# Altium schematic sheet adda副2.SchDoc
size A3
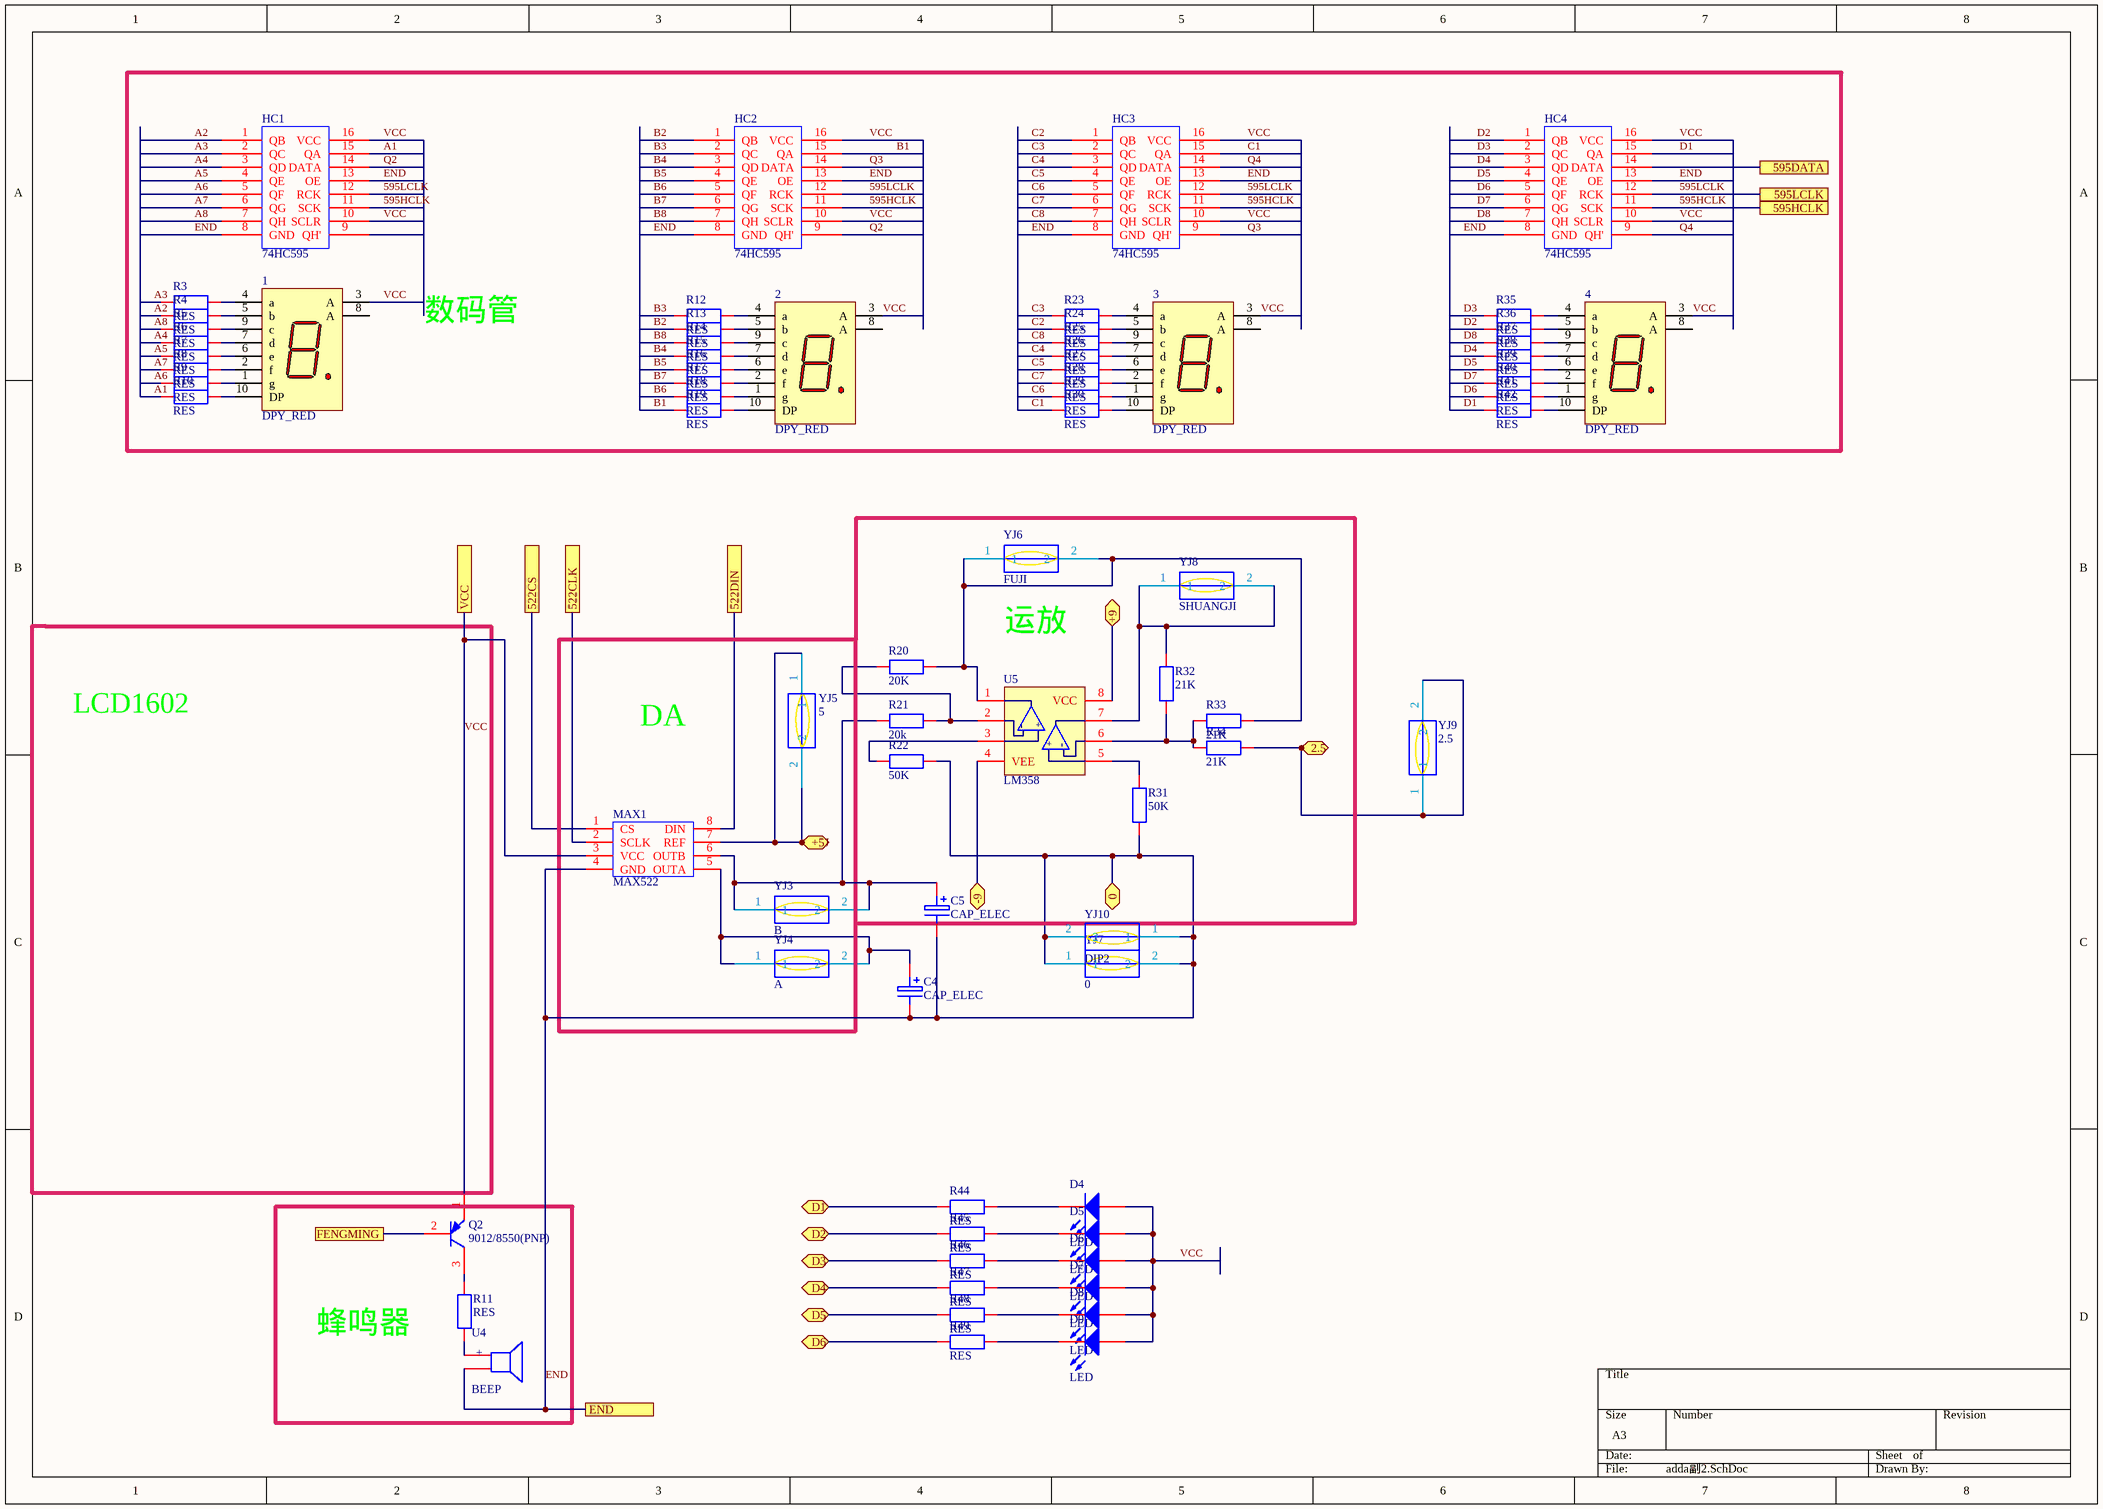
[diagram p0: adda副2.SchDoc]

## Parts
1  DPY_RED  [7SEG_8]
2  DPY_RED  [7SEG_8]
3  DPY_RED  [7SEG_8]
4  DPY_RED  [7SEG_8]
C4  CAP_ELEC  [CAP[16V]]
C5  CAP_ELEC  [CAP[16V]]
D4  LED  [LED]
D5  LED  [LED]
D6  LED  [LED]
D7  LED  [LED]
D8  LED  [LED]
D9  LED  [LED]
HC1  74HC595  [DIP_16]
HC2  74HC595  [DIP_16]
HC3  74HC595  [DIP_16]
HC4  74HC595  [DIP_16]
MAX1  MAX522  [DIP_8]
Q2  9012/8550(PNP)  [TO_92]
R3  RES  [RES_DIP]
R4  RES  [RES_DIP]
R5  RES  [RES_DIP]
R6  RES  [RES_DIP]
R7  RES  [RES_DIP]
R8  RES  [RES_DIP]
R9  RES  [RES_DIP]
R10  RES  [RES_DIP]
R11  RES  [RES_DIP]
R12  RES  [RES_DIP]
R13  RES  [RES_DIP]
R14  RES  [RES_DIP]
R15  RES  [RES_DIP]
R16  RES  [RES_DIP]
R17  RES  [RES_DIP]
R18  RES  [RES_DIP]
R19  RES  [RES_DIP]
R20  20K  [RES_DIP]
R21  20k  [RES_DIP]
R22  50K  [RES_DIP]
R23  RES  [RES_DIP]
R24  RES  [RES_DIP]
R25  RES  [RES_DIP]
R26  RES  [RES_DIP]
R27  RES  [RES_DIP]
R28  RES  [RES_DIP]
R29  RES  [RES_DIP]
R30  RES  [RES_DIP]
R31  50K  [RES_DIP]
R32  21K  [RES_DIP]
R33  21K  [RES_DIP]
R34  21K  [RES_DIP]
R35  RES  [RES_DIP]
R36  RES  [RES_DIP]
R37  RES  [RES_DIP]
R38  RES  [RES_DIP]
R39  RES  [RES_DIP]
R40  RES  [RES_DIP]
R41  RES  [RES_DIP]
R42  RES  [RES_DIP]
R44  RES  [RES_DIP]
R45  RES  [RES_DIP]
R46  RES  [RES_DIP]
R47  RES  [RES_DIP]
R48  RES  [RES_DIP]
R49  RES  [RES_DIP]
U4  BEEP  [BEEP]
U5  LM358  [DIP_8]
YJ3  B  [DIP2]
YJ4  A  [DIP2]
YJ5  5  [DIP2]
YJ6  FUJI  [DIP2]
YJ7  0  [DIP2]
YJ8  SHUANGJI  [DIP2]
YJ9  2.5  [DIP2]
YJ10  DIP2  [DIP2]

## Blocks framed on the sheet
数码管: 1-4 HC1-HC4 R3-R10 R12-R19 R23-R30 R35-R42
DA: MAX1 YJ3-YJ5
蜂鸣器: Q2 R11 U4

## Ports
0, 2.5, 522CLK, 522CS, 522DIN, 595DATA, 595HCLK, 595LCLK, +5J, +9, -9, D1, D2, D3, D4, D5, D6, END, FENGMING, VCC

## Nets
2.5: R34.1 YJ9.1 YJ9.2 ; port 2.5
522CLK: MAX1.2(SCLK) ; port 522CLK
522CS: MAX1.1(CS) ; port 522CS
522DIN: MAX1.8(DIN) ; port 522DIN
595DATA: HC4.14(DATA) ; port 595DATA
595HCLK: HC1.11(SCK) HC2.11(SCK) HC3.11(SCK) HC4.11(SCK) ; port 595HCLK
595LCLK: HC1.12(RCK) HC2.12(RCK) HC3.12(RCK) HC4.12(RCK) ; port 595LCLK
+5J: MAX1.7(REF) YJ5.1 YJ5.2 ; port +5J
+9: U5.8(VCC) ; port +9
-9: U5.4(VEE) ; port -9
A1: HC1.15(QA) R10.1
A2: HC1.1(QB) R4.1
A3: HC1.2(QC) R3.1
A4: HC1.3(QD) R6.1
A5: HC1.4(QE) R7.1
A6: HC1.5(QF) R9.1
A7: HC1.6(QG) R8.1
A8: HC1.7(QH) R5.1
B1: HC2.15(QA) R19.1
B2: HC2.1(QB) R13.1
B3: HC2.2(QC) R12.1
B4: HC2.3(QD) R15.1
B5: HC2.4(QE) R16.1
B6: HC2.5(QF) R18.1
B7: HC2.6(QG) R17.1
B8: HC2.7(QH) R14.1
C1: HC3.15(QA) R30.1
C2: HC3.1(QB) R24.1
C3: HC3.2(QC) R23.1
C4: HC3.3(QD) R26.1
C5: HC3.4(QE) R27.1
C6: HC3.5(QF) R29.1
C7: HC3.6(QG) R28.1
C8: HC3.7(QH) R25.1
D1: HC4.15(QA) R42.1
D1: R44.1 ; port D1  [a separate net that carries the same name]
D2: HC4.1(QB) R36.1
D2: R45.1 ; port D2  [a separate net that carries the same name]
D3: HC4.2(QC) R35.1
D3: R46.1 ; port D3  [a separate net that carries the same name]
D4: HC4.3(QD) R38.1
D4: R47.1 ; port D4  [a separate net that carries the same name]
D5: HC4.4(QE) R39.1
D5: R48.1 ; port D5  [a separate net that carries the same name]
D6: HC4.5(QF) R41.1
D6: R49.1 ; port D6  [a separate net that carries the same name]
D7: HC4.6(QG) R40.1
D8: HC4.7(QH) R37.1
END: C4.2 C5.2 HC1.8(GND) HC1.13(OE) HC2.8(GND) HC2.13(OE) HC3.8(GND) HC3.13(OE) HC4.8(GND) HC4.13(OE) MAX1.4(GND) R22.2 R31.1 U4.2 YJ7.1 YJ7.2 YJ10.1 YJ10.2 ; port END, port 0
FENGMING: Q2.2(B) ; port FENGMING
Q2: HC1.14(DATA) HC2.9(QH')
Q3: HC2.14(DATA) HC3.9(QH')
Q4: HC3.14(DATA) HC4.9(QH')
VCC: 1.3(A) 2.3(A) 3.3(A) 4.3(A) D4.1(A) D5.1(A) D6.1(A) D7.1(A) D8.1(A) D9.1(A) HC1.10(SCLR) HC1.16(VCC) HC2.10(SCLR) HC2.16(VCC) HC3.10(SCLR) HC3.16(VCC) HC4.10(SCLR) HC4.16(VCC) MAX1.3(VCC) Q2.1(E) ; port VCC
Net1_1: 1.1(g) R9.2
Net1_2: 1.2(f) R8.2
Net1_4: 1.4(a) R3.2
Net1_5: 1.5(b) R4.2
Net1_6: 1.6(e) R7.2
Net1_7: 1.7(d) R6.2
Net1_9: 1.9(c) R5.2
Net1_10: 1.10(DP) R10.2
Net2_1: 2.1(g) R18.2
Net2_2: 2.2(f) R17.2
Net2_4: 2.4(a) R12.2
Net2_5: 2.5(b) R13.2
Net2_6: 2.6(e) R16.2
Net2_7: 2.7(d) R15.2
Net2_9: 2.9(c) R14.2
Net2_10: 2.10(DP) R19.2
Net3_1: 3.1(g) R29.2
Net3_2: 3.2(f) R28.2
Net3_4: 3.4(a) R23.2
Net3_5: 3.5(b) R24.2
Net3_6: 3.6(e) R27.2
Net3_7: 3.7(d) R26.2
Net3_9: 3.9(c) R25.2
Net3_10: 3.10(DP) R30.2
Net4_1: 4.1(g) R41.2
Net4_2: 4.2(f) R40.2
Net4_4: 4.4(a) R35.2
Net4_5: 4.5(b) R36.2
Net4_6: 4.6(e) R39.2
Net4_7: 4.7(d) R38.2
Net4_9: 4.9(c) R37.2
Net4_10: 4.10(DP) R42.2
NetC4_1: C4.1 MAX1.5(OUTA) YJ4.1 YJ4.2
NetC5_1: C5.1 MAX1.6(OUTB) R21.1 YJ3.1 YJ3.2
NetD4_2: D4.2(K) R44.2
NetD5_2: D5.2(K) R45.2
NetD6_2: D6.2(K) R46.2
NetD7_2: D7.2(K) R47.2
NetD8_2: D8.2(K) R48.2
NetD9_2: D9.2(K) R49.2
NetQ2_3: Q2.3(C) R11.2
NetR11_1: R11.1 U4.1
NetR20_1: R20.1 R21.2 U5.2(IN1-)
NetR20_2: R20.2 R33.2 U5.1(OUTA) YJ6.1 YJ6.2
NetR22_1: R22.1 U5.3(IN1+)
NetR31_2: R31.2 U5.5(IN2+)
NetR32_1: R32.1 R33.1 R34.2 U5.6(IN2-)
NetR32_2: R32.2 U5.7(OUTB) YJ8.1 YJ8.2

Not connected (* = marked no-connect by the designer): 1 8(A); 2 8(A); 3 8(A); 4 8(A); HC1 9(QH')

## Notes on the sheet
- 运放
- LCD1602
- (in symbol BEEP) +
- (in symbol LM358) -; +

## Library data of the parts
Q2 = 9012/8550(PNP): PNP
R20-R22 R31-R34 = RES
YJ3-YJ9 = DIP2